# EAGLE design KeyboardTransformer (EAGLE 6.4)

## Sheet 1 of 3
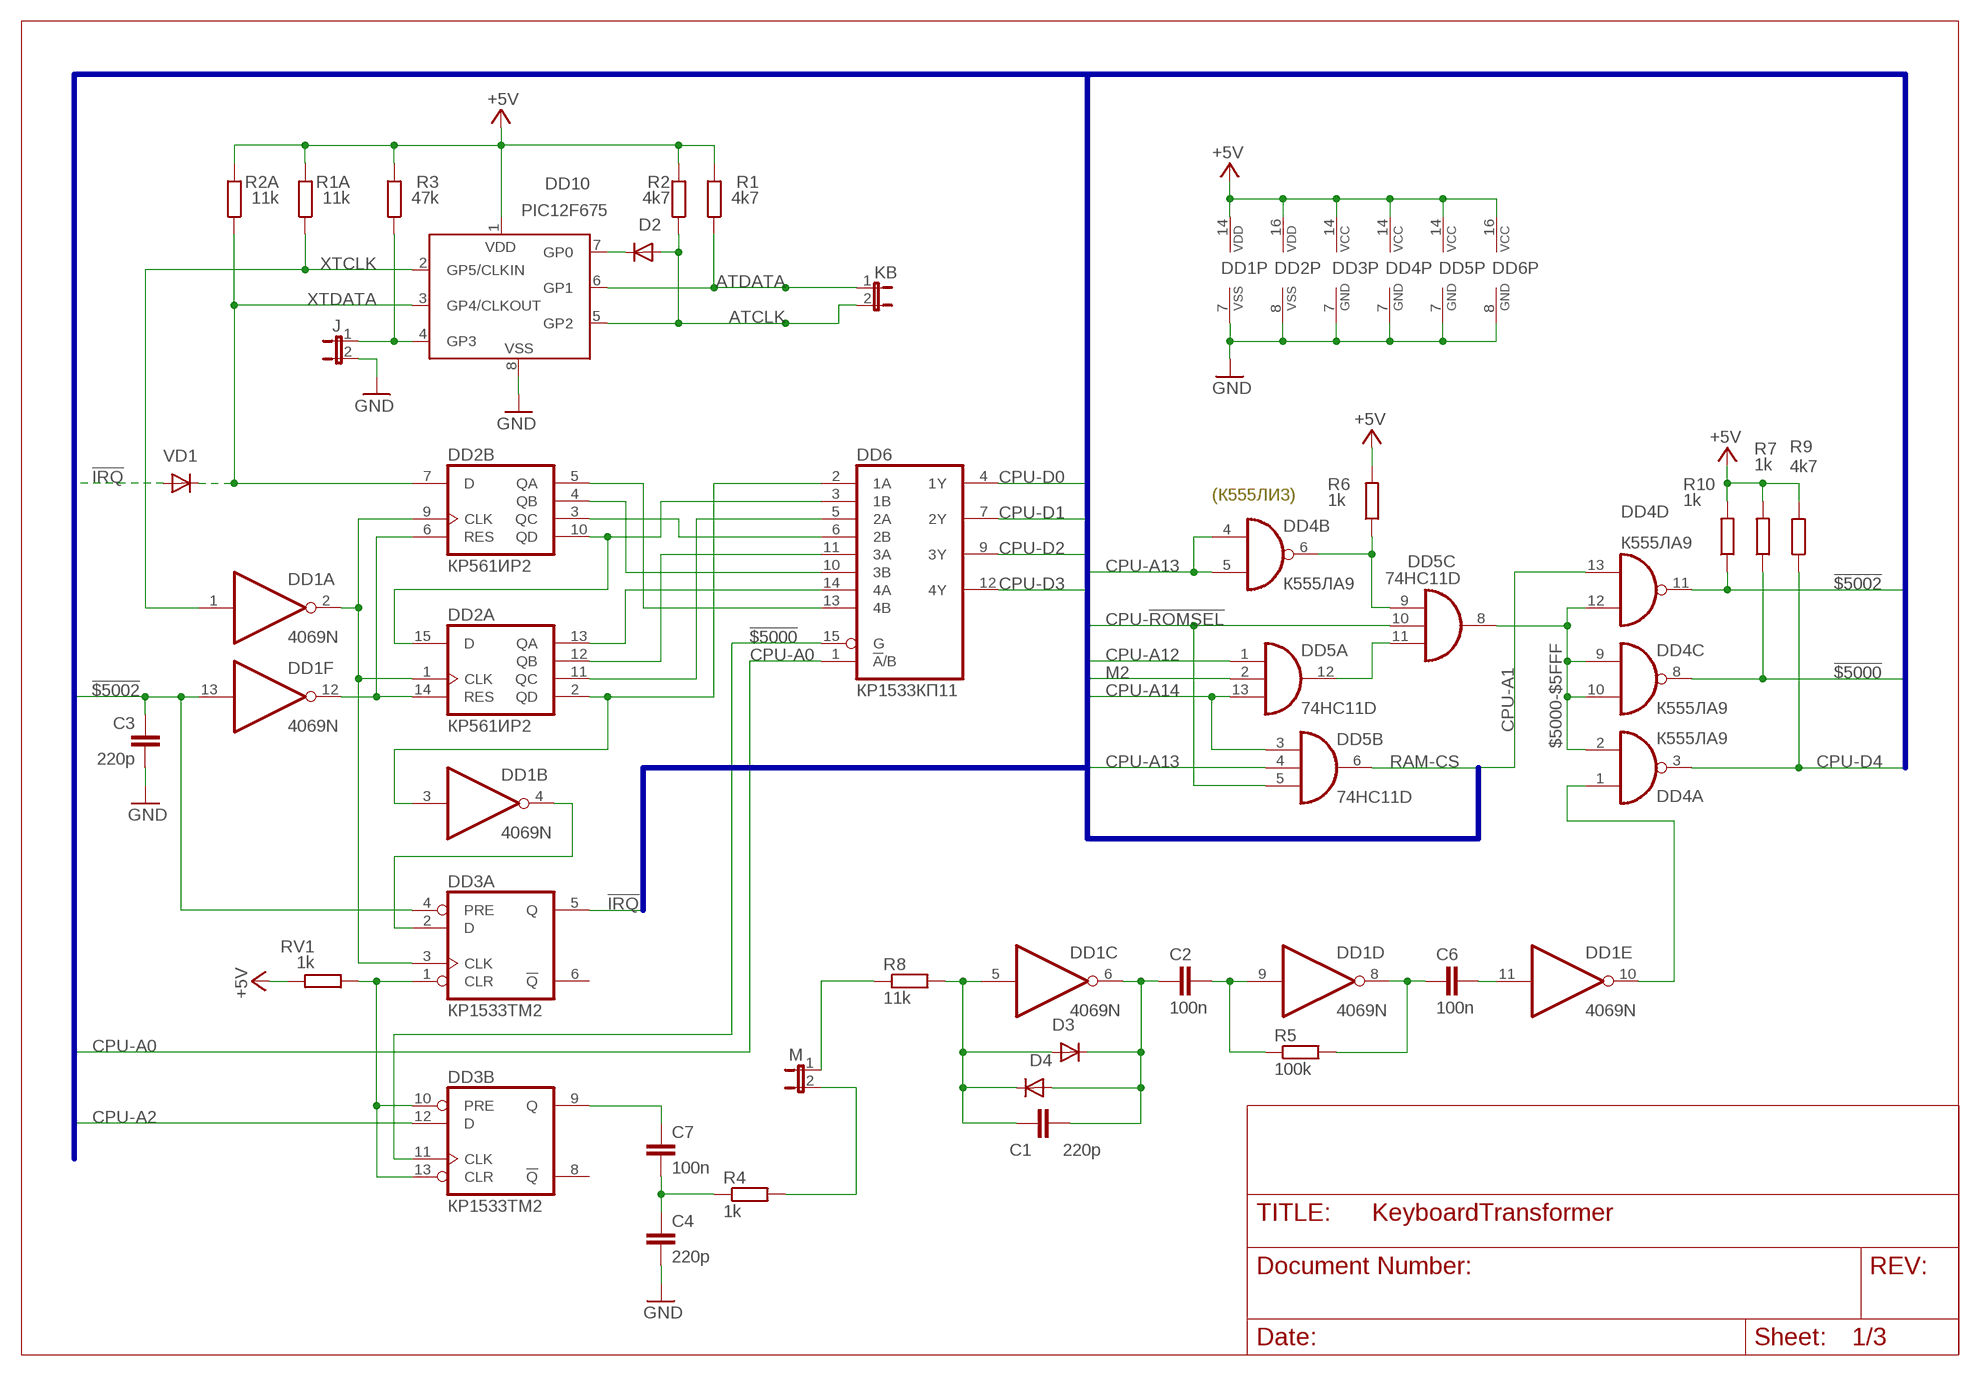
[diagram p0: schematic, sheet 1]

### Parts
C1  220p  C-EUC0805  [C0805]
C2  100n  C-EUC0805  [C0805]
C3  220p  C-EUC0805  [C0805]
C4  220p  C-EUC0805  [C0805]
C6  100n  C-EUC0805  [C0805]
C7  100n  C-EUC0805  [C0805]
D2  DIODE-SOD80C  [SOD80C]
D3  DIODE-SOD80C  [SOD80C]
D4  DIODE-SOD80C  [SOD80C]
DD1  4069N  [DIL14]
DD2  КР561ИР2  4015N  [DIL16]
DD3  КР1533ТМ2  74LS74N  [DIL14]
DD4  К555ЛА9  74LS03N  [DIL14]
DD5  74HC11D  [SO14]
DD6  КР1533КП11  74HC257N  [DIL16]
DD10  PIC12F675  PIC12F675SN  [SO-08]
J  JP1E  [JP1]
KB  JP1E  [JP1]
M  JP1E  [JP1]
R1  4k7  R-EU_M0805  [M0805]
R1A  11k  R-EU_M0805  [M0805]
R2  4k7  R-EU_M0805  [M0805]
R2A  11k  R-EU_M0805  [M0805]
R3  47k  R-EU_M0805  [M0805]
R4  1k  R-EU_M0805  [M0805]
R5  100k  R-EU_M0805  [M0805]
R6  1k  R-EU_M0805  [M0805]
R7  1k  R-EU_M0805  [M0805]
R8  11k  R-EU_M0805  [M0805]
R9  4k7  R-EU_M0805  [M0805]
R10  1k  R-EU_M0805  [M0805]
RV1  1k  R-EU_M0805  [M0805]
VD1  DIODE-SOD80C  [SOD80C]

### Nets
!$5000: DD3.11(B:CLK) DD4.8(C:O) DD6.15(G) R7.1
!$5002: C3.1 DD1.13(F:I) DD3.4(A:PRE) DD4.11(D:O) R10.1
!IRQ: DD3.5(A:Q) VD1.A ; also sheet 2
$5000-$5FFF: DD4.2(A:I1) DD4.9(C:I0) DD4.10(C:I1) DD4.12(D:I0) DD5.8(C:O)
+5V: DD1.14(P:VDD) DD2.16(P:VDD) DD3.14(P:VCC) DD4.14(P:VCC) DD5.14(P:VCC) DD6.16(VCC) DD10.1(VDD) R1.2 R1A.2 R2.2 R2A.2 R3.2 R6.2 R7.2 R9.2 R10.2 RV1.2 ; also sheet 2
ATCLK: D2.A DD10.5(GP2) KB.2 R2.1
ATDATA: DD10.6(GP1) KB.1 R1.1
CPU-!ROMSEL: DD5.5(B:I2) DD5.10(C:I1) ; also sheet 2,3
CPU-A0: DD6.1(!A!/B) ; also sheet 2
CPU-A1: DD4.13(D:I1) ; also sheet 2
CPU-A2: DD3.12(B:D) ; also sheet 2
CPU-A12: DD5.1(A:I0) ; also sheet 2,3
CPU-A13: DD4.4(B:I0) DD4.5(B:I1) DD5.4(B:I1) ; also sheet 2,3
CPU-A14: DD5.3(B:I0) DD5.13(A:I2) ; also sheet 2,3
CPU-D0: DD6.4(1Y) ; also sheet 2
CPU-D1: DD6.7(2Y) ; also sheet 2
CPU-D2: DD6.9(3Y) ; also sheet 2
CPU-D3: DD6.12(4Y) ; also sheet 2
CPU-D4: DD4.3(A:O) R9.1 ; also sheet 2
GND: C3.2 C4.2 DD1.7(P:VSS) DD2.8(P:VSS) DD3.7(P:GND) DD4.7(P:GND) DD5.7(P:GND) DD6.8(GND) DD10.8(VSS) J.2 ; also sheet 2
M2: DD5.2(A:I1) ; also sheet 2,3
N$1: DD3.1(A:CLR) DD3.10(B:PRE) DD3.13(B:CLR) RV1.1
N$2: DD2.10(B:QD) DD2.15(A:D) DD6.3(1B)
N$3: DD1.12(F:O) DD2.6(B:RES) DD2.14(A:RES)
N$4: DD1.2(A:O) DD2.1(A:CLK) DD2.9(B:CLK) DD3.3(A:CLK)
N$5: DD2.5(B:QA) DD6.13(4B)
N$6: DD2.4(B:QB) DD6.10(3B)
N$7: D2.C DD10.7(GP0)
N$8: DD2.3(B:QC) DD6.6(2B)
N$9: DD2.13(A:QA) DD6.14(4A)
N$10: DD2.12(A:QB) DD6.11(3A)
N$11: DD2.11(A:QC) DD6.5(2A)
N$12: DD10.4(GP3) J.1 R3.1
N$13: DD1.3(B:I) DD2.2(A:QD) DD6.2(1A)
N$14: DD1.4(B:O) DD3.2(A:D)
N$15: DD5.11(C:I2) DD5.12(A:O)
N$16: C7.1 DD3.9(B:Q)
N$17: C4.1 C7.2 R4.1
N$18: M.1 R8.1
N$19: DD4.6(B:O) DD5.9(C:I0) R6.1
N$20: C1.1 D3.A D4.C DD1.5(C:I) R8.2
N$21: C1.2 C2.1 D3.C D4.A DD1.6(C:O)
N$22: C6.2 DD1.11(E:I)
N$24: DD1.10(E:O) DD4.1(A:I0)
N$26: C2.2 DD1.9(D:I) R5.1
N$28: C6.1 DD1.8(D:O) R5.2
N$29: M.2 R4.2
RAM-CS: DD5.6(B:O) ; also sheet 2
XTCLK: DD1.1(A:I) DD10.2(GP5/CLKIN) R1A.1
XTDATA: DD2.7(B:D) DD10.3(GP4/CLKOUT) R2A.1 VD1.C
Unconnected: DD3.6(A:!Q) DD3.8(B:!Q)

### Buses
B$1

### Notes on the sheet
- (К555ЛИ3)

## Sheet 2 of 3
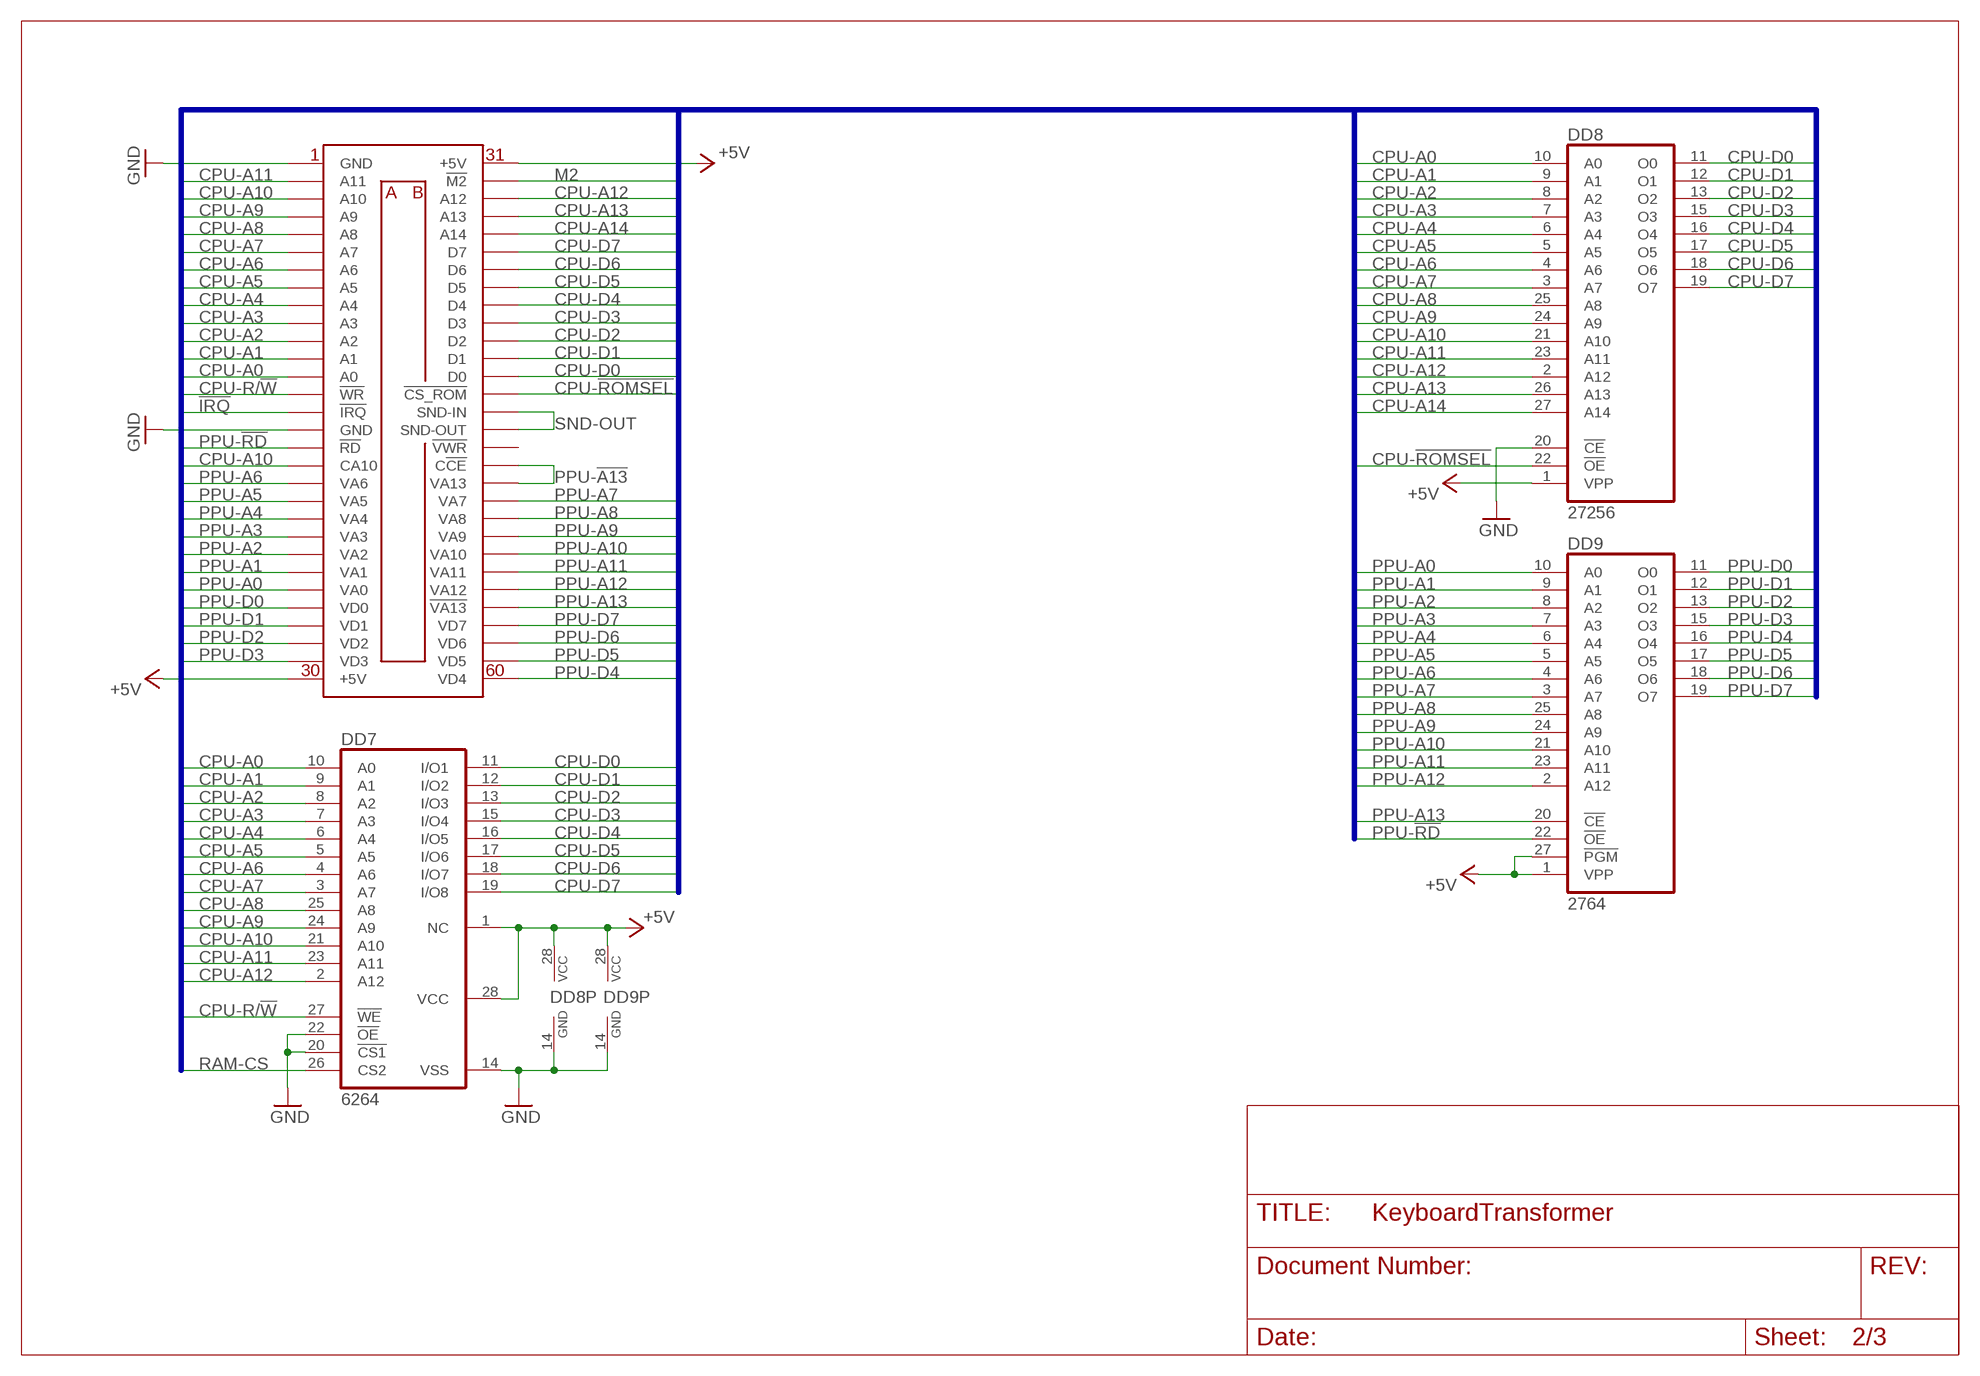
[diagram p1: schematic, sheet 2]

### Parts
DD7  6264  6264A  [DIL28-6]
DD8  27256  [DIL28]
DD9  2764  [DIL28]
U$1  CON60  [CON60]

### Nets
!IRQ: U$1.P$15(!IRQ) ; also sheet 1
+5V: DD7.1(NC) DD7.28(VCC) DD8.1(VPP) DD8.28(VCC) DD9.1(VPP) DD9.27(!PGM) DD9.28(VCC) U$1.P$30(+5V) U$1.P$31(+5V) ; also sheet 1
CPU-!ROMSEL: DD8.22(!OE) U$1.P$44(!CS_ROM) ; also sheet 1,3
CPU-A0: DD7.10(A0) DD8.10(A0) U$1.P$13(A0) ; also sheet 1
CPU-A1: DD7.9(A1) DD8.9(A1) U$1.P$12(A1) ; also sheet 1
CPU-A2: DD7.8(A2) DD8.8(A2) U$1.P$11(A2) ; also sheet 1
CPU-A3: DD7.7(A3) DD8.7(A3) U$1.P$10(A3)
CPU-A4: DD7.6(A4) DD8.6(A4) U$1.P$9(A4)
CPU-A5: DD7.5(A5) DD8.5(A5) U$1.P$8(A5)
CPU-A6: DD7.4(A6) DD8.4(A6) U$1.P$7(A6)
CPU-A7: DD7.3(A7) DD8.3(A7) U$1.P$6(A7)
CPU-A8: DD7.25(A8) DD8.25(A8) U$1.P$5(A8)
CPU-A9: DD7.24(A9) DD8.24(A9) U$1.P$4(A9)
CPU-A10: DD7.21(A10) DD8.21(A10) U$1.P$3(A10) U$1.P$18(CA10)
CPU-A11: DD7.23(A11) DD8.23(A11) U$1.P$2(A11)
CPU-A12: DD7.2(A12) DD8.2(A12) U$1.P$33(A12) ; also sheet 1,3
CPU-A13: DD8.26(A13) U$1.P$34(A13) ; also sheet 1,3
CPU-A14: DD8.27(A14) U$1.P$35(A14) ; also sheet 1,3
CPU-D0: DD7.11(I/O1) DD8.11(O0) U$1.P$43(D0) ; also sheet 1
CPU-D1: DD7.12(I/O2) DD8.12(O1) U$1.P$42(D1) ; also sheet 1
CPU-D2: DD7.13(I/O3) DD8.13(O2) U$1.P$41(D2) ; also sheet 1
CPU-D3: DD7.15(I/O4) DD8.15(O3) U$1.P$40(D3) ; also sheet 1
CPU-D4: DD7.16(I/O5) DD8.16(O4) U$1.P$39(D4) ; also sheet 1
CPU-D5: DD7.17(I/O6) DD8.17(O5) U$1.P$38(D5)
CPU-D6: DD7.18(I/O7) DD8.18(O6) U$1.P$37(D6)
CPU-D7: DD7.19(I/O8) DD8.19(O7) U$1.P$36(D7)
CPU-R/!W: DD7.27(!WE) U$1.P$14(!WR)
GND: DD7.14(VSS) DD7.20(!CS1) DD7.22(!OE) DD8.14(GND) DD8.20(!CE) DD9.14(GND) U$1.P$1(GND) U$1.P$16(GND) ; also sheet 1
M2: U$1.P$32(!M2) ; also sheet 1,3
PPU-!A13: U$1.P$48(C!CE) U$1.P$49(VA13)
PPU-!RD: DD9.22(!OE) U$1.P$17(!RD)
PPU-A0: DD9.10(A0) U$1.P$25(VA0)
PPU-A1: DD9.9(A1) U$1.P$24(VA1)
PPU-A2: DD9.8(A2) U$1.P$23(VA2)
PPU-A3: DD9.7(A3) U$1.P$22(VA3)
PPU-A4: DD9.6(A4) U$1.P$21(VA4)
PPU-A5: DD9.5(A5) U$1.P$20(VA5)
PPU-A6: DD9.4(A6) U$1.P$19(VA6)
PPU-A7: DD9.3(A7) U$1.P$50(VA7)
PPU-A8: DD9.25(A8) U$1.P$51(VA8)
PPU-A9: DD9.24(A9) U$1.P$52(VA9)
PPU-A10: DD9.21(A10) U$1.P$53(VA10)
PPU-A11: DD9.23(A11) U$1.P$54(VA11)
PPU-A12: DD9.2(A12) U$1.P$55(VA12)
PPU-A13: DD9.20(!CE) U$1.P$56(!VA13)
PPU-D0: DD9.11(O0) U$1.P$26(VD0)
PPU-D1: DD9.12(O1) U$1.P$27(VD1)
PPU-D2: DD9.13(O2) U$1.P$28(VD2)
PPU-D3: DD9.15(O3) U$1.P$29(VD3)
PPU-D4: DD9.16(O4) U$1.P$60(VD4)
PPU-D5: DD9.17(O5) U$1.P$59(VD5)
PPU-D6: DD9.18(O6) U$1.P$58(VD6)
PPU-D7: DD9.19(O7) U$1.P$57(VD7)
RAM-CS: DD7.26(CS2) ; also sheet 1
SND-OUT: U$1.P$45(SND-IN) U$1.P$46(SND-OUT)
Unconnected: U$1.P$47(!VWR)

### Buses
CPU-A[0..14],CPU-D[0..7],CPU-R/!W,CPU-!ROMSEL,PPU-A[0..13],PPU-D[0..7],PPU-!RD,RAM-CS,!IRQ,M2

## Sheet 3 of 3
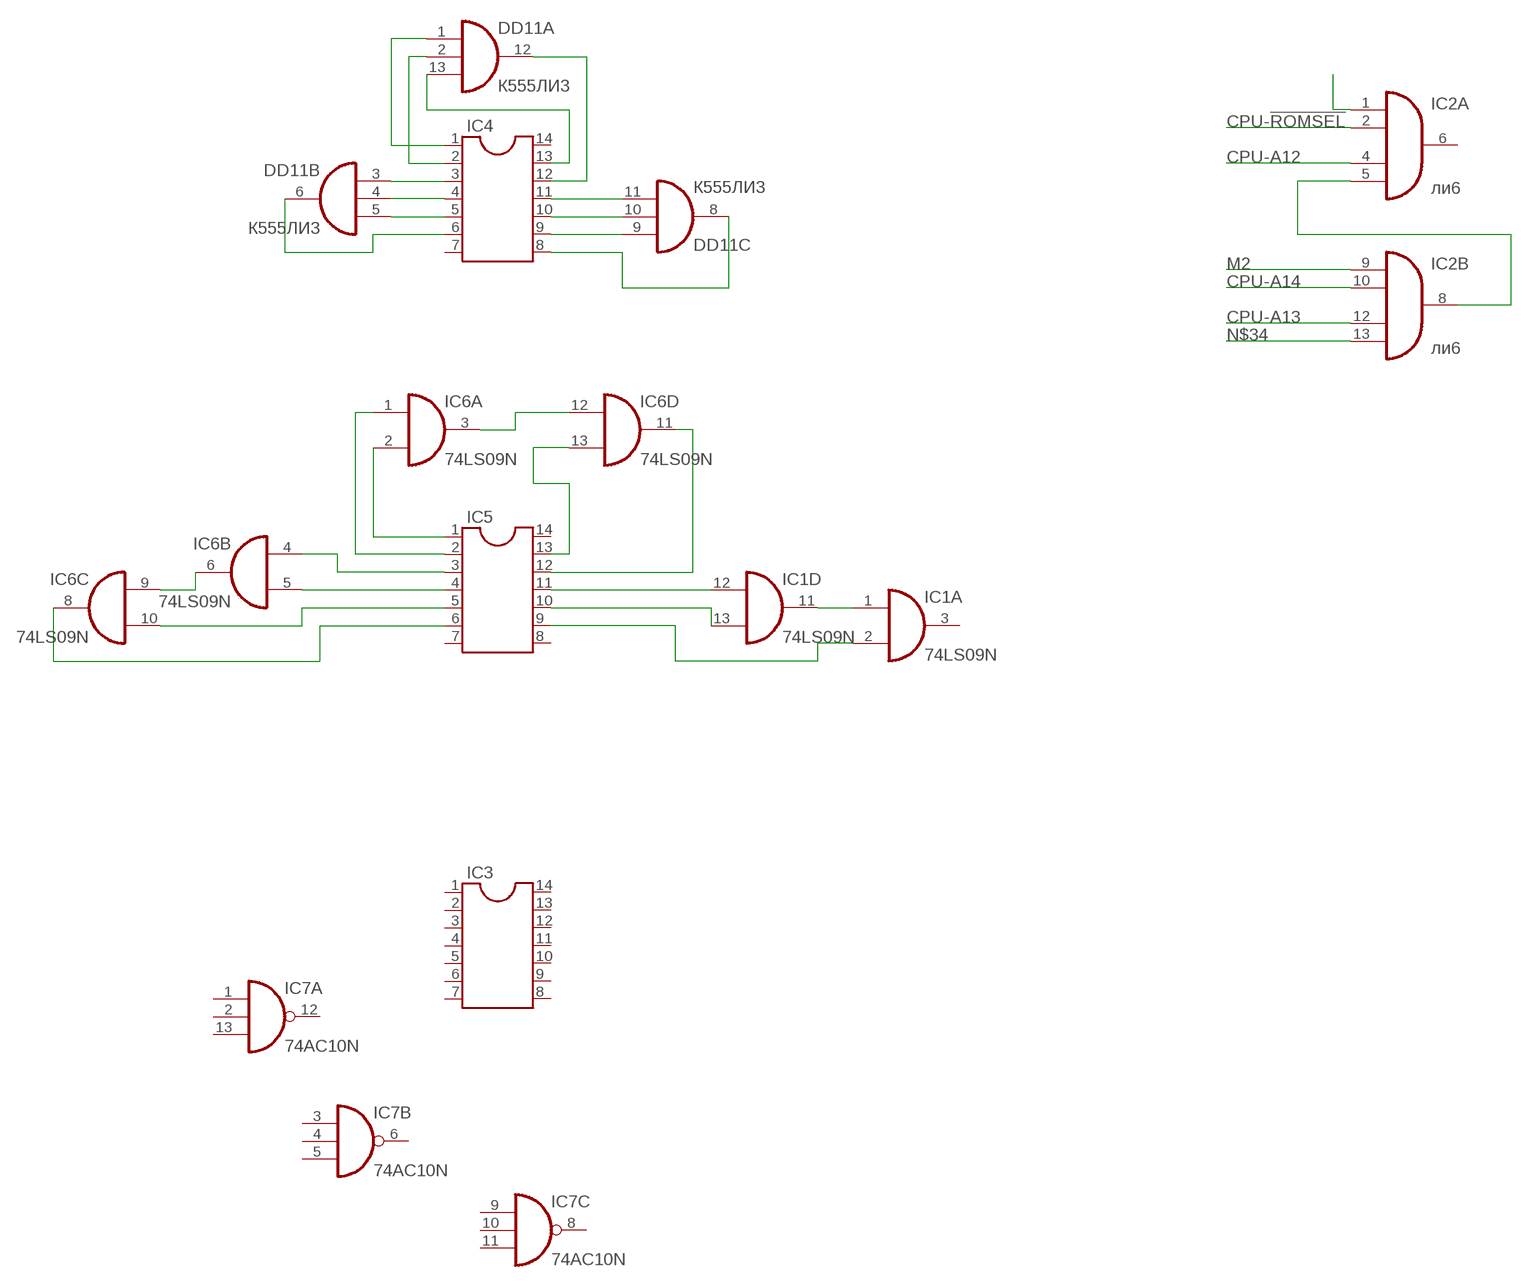
[diagram p2: schematic, sheet 3]

### Parts
DD11  К555ЛИ3  74HC11N  [DIL14]
IC1  74LS09N  [DIL14]
IC2  ли6  74AC21N  [DIL14]
IC3  DIL14  [DIL14]
IC4  DIL14  [DIL14]
IC5  DIL14  [DIL14]
IC6  74LS09N  [DIL14]
IC7  74AC10N  [DIL14]

### Nets
CPU-!ROMSEL: IC2.2(A:I1) ; also sheet 1,2
CPU-A12: IC2.4(A:I2) ; also sheet 1,2
CPU-A13: IC2.12(B:I2) ; also sheet 1,2
CPU-A14: IC2.10(B:I1) ; also sheet 1,2
M2: IC2.9(B:I0) ; also sheet 1,2
N$23: IC6.3(A:O) IC6.12(D:I0)
N$25: IC5.1 IC6.2(A:I1)
N$27: IC5.2 IC6.1(A:I0)
N$30: IC5.13 IC6.13(D:I1)
N$31: IC5.12 IC6.11(D:O)
N$32: DD11.13(A:I2) IC4.13
N$33: IC2.5(A:I3) IC2.8(B:O)
N$34: IC2.13(B:I3)
N$35: DD11.12(A:O) IC4.12
N$36: DD11.2(A:I1) IC4.2
N$37: DD11.1(A:I0) IC4.1
N$38: IC2.1(A:I0)
N$39: DD11.3(B:I0) IC4.3
N$40: DD11.4(B:I1) IC4.4
N$41: DD11.5(B:I2) IC4.5
N$42: DD11.6(B:O) IC4.6
N$43: DD11.11(C:I2) IC4.11
N$44: DD11.10(C:I1) IC4.10
N$45: DD11.9(C:I0) IC4.9
N$46: DD11.8(C:O) IC4.8
N$47: IC5.3 IC6.4(B:I0)
N$48: IC5.4 IC6.5(B:I1)
N$49: IC6.6(B:O) IC6.9(C:I0)
N$50: IC5.5 IC6.10(C:I1)
N$51: IC5.6 IC6.8(C:O)
N$52: IC1.12(D:I0) IC5.11
N$53: IC1.13(D:I1) IC5.10
N$54: IC1.1(A:I0) IC1.11(D:O)
N$55: IC1.2(A:I1) IC5.9
Unconnected: IC1.3(A:O) IC1.4(B:I0) IC1.5(B:I1) IC1.6(B:O) IC1.8(C:O) IC1.9(C:I0) IC1.10(C:I1) IC2.6(A:O) IC3.1 IC3.2 IC3.3 IC3.4 IC3.5 IC3.6 IC3.7 IC3.8 IC3.9 IC3.10 IC3.11 IC3.12 IC3.13 IC3.14 IC4.7 IC4.14 IC5.7 IC5.8 IC5.14 IC7.1(A:I0) IC7.2(A:I1) IC7.3(B:I0) IC7.4(B:I1) IC7.5(B:I2) IC7.6(B:O) IC7.8(C:O) IC7.9(C:I0) IC7.10(C:I1) IC7.11(C:I2) IC7.12(A:O) IC7.13(A:I2)

## Power pins joined to a net without a drawn wire
GND: DD11.7(P:GND) IC1.7(P:GND) IC2.7(P:GND) IC6.7(P:GND) IC7.7(P:GND)
VCC: DD11.14(P:VCC) IC1.14(P:VCC) IC2.14(P:VCC) IC6.14(P:VCC) IC7.14(P:VCC)

## Library data of the parts
C1-C4 C6 C7 = rcl:C-EU: CAPACITOR, European symbol
D2-D4 VD1 = diode:DIODE-: DIODE
DD1 = 40xx:4069: Hex INVERTER
DD2 = 40xx:4015: Dual 4-bit static SHIFT REGISTER
DD3 = 74xx-eu:74*74: Dual D type positive edge triggered FLIP FLOP, preset and clear
DD4 = 74xx-eu:74*03: Quad 2-input NAND gate, open collector output
DD5 DD11 = 74xx-eu:74*11: Triple 3-input AND gate
DD6 = 74xx-eu:74*257: Quadruple 2-to 1 line data SELECTOR/MULTIPLEXER
DD7 = memory-hitachi:6264A: MEMORY; OC_FARNELL: 283605; OC_NEWARK: unknown
DD8 = memory:27256: MEMORY
DD9 = memory:2764: MEMORY
DD10 = microchip:PIC12F6*: Data Sheet 8-Pin FLASH-Based 8-Bit CMOS Microcontrollers Source: http://www.microchip.com .. 41190c.pdf; MF: MICROCHIP; MPN: PIC12F675-E/SN; OC_FARNELL: 9759026; OC_NEWARK: 92C4341
IC1 IC6 = 74xx-eu:74*09: Quad 2-input AND gate, open collector
IC2 = 74xx-eu:74*21: Dual 4-input AND gate
IC3-IC5 = ic-package:DIL14: Dual In Line / Socket
IC7 = 74xx-eu:74*10: Triple 3-input NAND gate
J KB M = jumper:JP1E: JUMPER
R1 R1A R2 R2A R3-R10 RV1 = rcl:R-EU_: RESISTOR, European symbol
U$1 = dkt:CON60

## Board
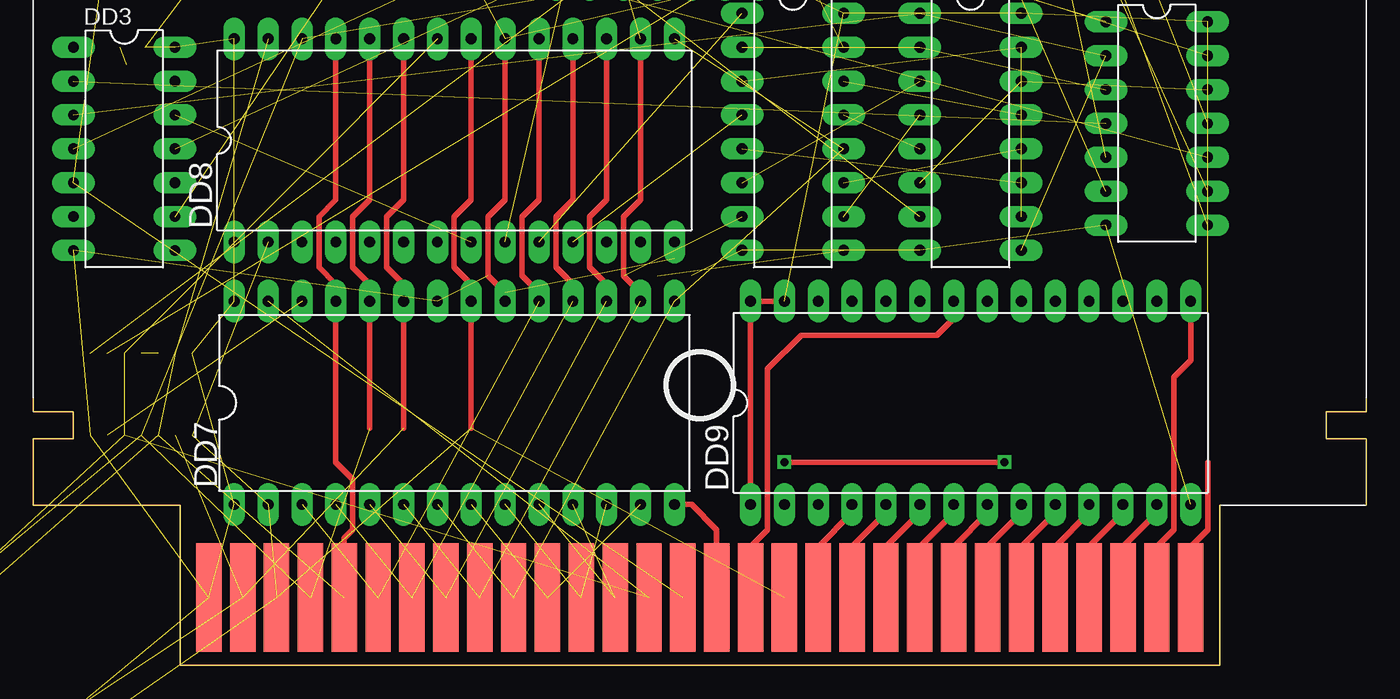
[diagram p3: board, top side]
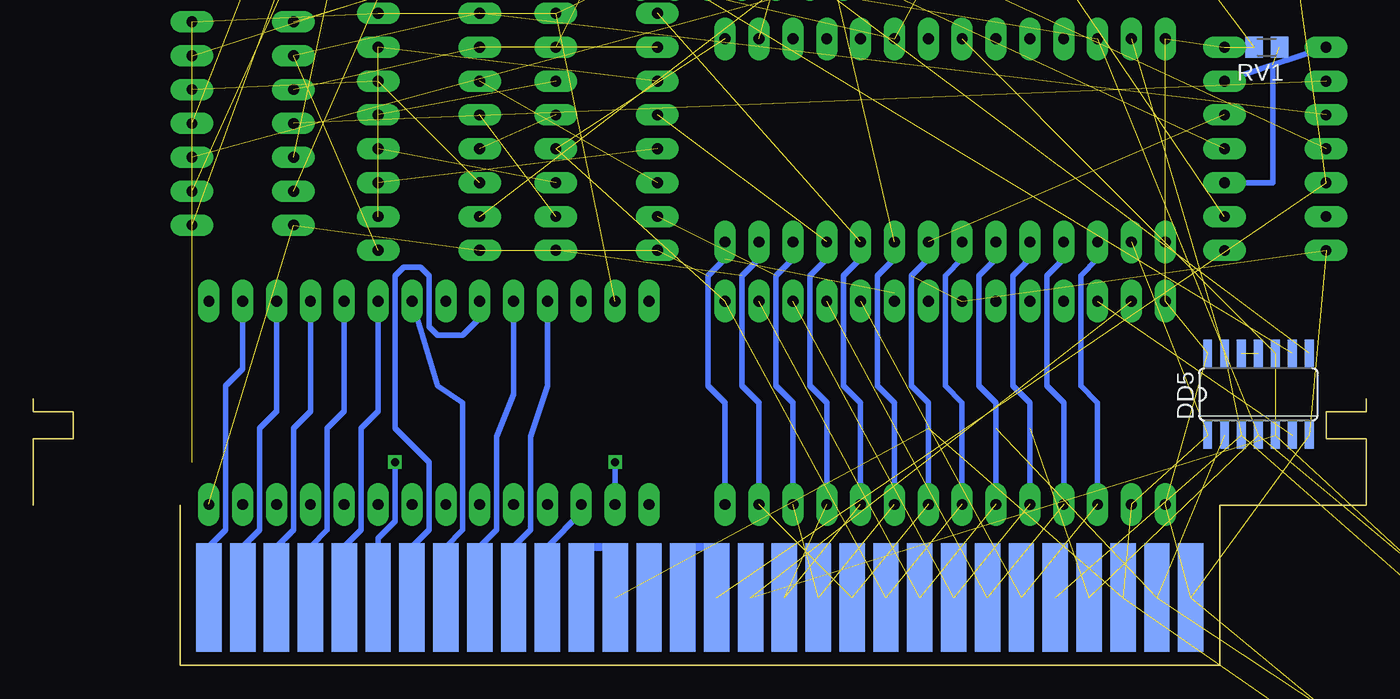
[diagram p4: board, bottom side, seen from below]

Size 100 x 20 mm. Coordinates in mm from the lower left corner, seen from the top.
Copper layers (1*16): Top 0.035mm / dielectric 1.5mm / Bottom 0.035mm
Design rules "default": minimum track width 10mil, minimum drill 24mil, track to track 8mil, track to pad 8mil, pad to pad 8mil, via to via 8mil, smd to smd 8mil, copper to edge 40mil, drill to drill 7mil, minimum pad ring 0.4mm, minimum via ring 8mil, stop-mask expansion 4mil, vias tented up to drill 0mil, thermal gap 10mil

### Footprints (pad centres in the part's own frame; a part is rotated, then mirrored left to right if it is on the bottom)
C0805 = smd 1.3 x 1.5: 1 -0.95,0; 2 0.95,0
SOD80C = smd 1.4 x 1.8: A 1.7,0; C -1.7,0
DIL14 = drill 0.813 long: 1 -7.62,-3.81; 2 -5.08,-3.81; 3 -2.54,-3.81; 4 0,-3.81; 5 2.54,-3.81; 6 5.08,-3.81; 7 7.62,-3.81; 8 7.62,3.81; 9 5.08,3.81; 10 2.54,3.81; 11 0,3.81; 12 -2.54,3.81; 13 -5.08,3.81; 14 -7.62,3.81
DIL16 = drill 0.813 long: 1 -8.89,-3.81; 2 -6.35,-3.81; 3 -3.81,-3.81; 4 -1.27,-3.81; 5 1.27,-3.81; 6 3.81,-3.81; 7 6.35,-3.81; 8 8.89,-3.81; 9 8.89,3.81; 10 6.35,3.81; 11 3.81,3.81; 12 1.27,3.81; 13 -1.27,3.81; 14 -3.81,3.81; 15 -6.35,3.81; 16 -8.89,3.81
SO14 = smd 0.66 x 2.032: 1 -3.81,-3.073; 2 -2.54,-3.073; 3 -1.27,-3.073; 4 0,-3.073; 5 1.27,-3.073; 6 2.54,-3.073; 7 3.81,-3.073; 8 3.81,3.073; 9 2.54,3.073; 10 1.27,3.073; 11 0,3.073; 12 -1.27,3.073; 13 -2.54,3.073; 14 -3.81,3.073
DIL28-6 = drill 0.813 long: 1 -16.51,-7.62; 2 -13.97,-7.62; 3 -11.43,-7.62; 4 -8.89,-7.62; 5 -6.35,-7.62; 6 -3.81,-7.62; 7 -1.27,-7.62; 8 1.27,-7.62; 9 3.81,-7.62; 10 6.35,-7.62; 11 8.89,-7.62; 12 11.43,-7.62; 13 13.97,-7.62; 14 16.51,-7.62; 15 16.51,7.62; 16 13.97,7.62; 17 11.43,7.62; 18 8.89,7.62; 19 6.35,7.62; 20 3.81,7.62; 21 1.27,7.62; 22 -1.27,7.62; 23 -3.81,7.62; 24 -6.35,7.62; 25 -8.89,7.62; 26 -11.43,7.62; 27 -13.97,7.62; 28 -16.51,7.62
DIL28 = drill 0.813 long: 1 -16.51,-7.62; 2 -13.97,-7.62; 3 -11.43,-7.62; 4 -8.89,-7.62; 5 -6.35,-7.62; 6 -3.81,-7.62; 7 -1.27,-7.62; 8 1.27,-7.62; 9 3.81,-7.62; 10 6.35,-7.62; 11 8.89,-7.62; 12 11.43,-7.62; 13 13.97,-7.62; 14 16.51,-7.62; 15 16.51,7.62; 16 13.97,7.62; 17 11.43,7.62; 18 8.89,7.62; 19 6.35,7.62; 20 3.81,7.62; 21 1.27,7.62; 22 -1.27,7.62; 23 -3.81,7.62; 24 -6.35,7.62; 25 -8.89,7.62; 26 -11.43,7.62; 27 -13.97,7.62; 28 -16.51,7.62
SO-08 = smd 0.6 x 2.2: 1 -1.905,-2.6; 2 -0.635,-2.6; 3 0.635,-2.6; 4 1.905,-2.6; 5 1.905,2.6; 6 0.635,2.6; 7 -0.635,2.6; 8 -1.905,2.6
JP1 = drill 0.914 long: 1 0,-1.27; 2 0,1.27
M0805 = smd 1.3 x 1.6: 1 -0.95,0; 2 0.95,0
CON60 = smd 1.905 x 8.128: P$1 -36.83,5.08; P$2 -34.29,5.08; P$3 -31.75,5.08; P$4 -29.21,5.08; P$5 -26.67,5.08; P$6 -24.13,5.08; P$7 -21.59,5.08; P$8 -19.05,5.08; P$9 -16.51,5.08; P$10 -13.97,5.08; P$11 -11.43,5.08; P$12 -8.89,5.08; P$13 -6.35,5.08; P$14 -3.81,5.08; P$15 -1.27,5.08; P$16 1.27,5.08; P$17 3.81,5.08; P$18 6.35,5.08; P$19 8.89,5.08; P$20 11.43,5.08; P$21 13.97,5.08; P$22 16.51,5.08; P$23 19.05,5.08; P$24 21.59,5.08; P$25 24.13,5.08; P$26 26.67,5.08; P$27 29.21,5.08; P$28 31.75,5.08; P$29 34.29,5.08; P$30 36.83,5.08 | smd 1.905 x 8.128 bottom: P$31 -36.83,5.08; P$32 -34.29,5.08; P$33 -31.75,5.08; P$34 -29.21,5.08; P$35 -26.67,5.08; P$36 -24.13,5.08; P$37 -21.59,5.08; P$38 -19.05,5.08; P$39 -16.51,5.08; P$40 -13.97,5.08; P$41 -11.43,5.08; P$42 -8.89,5.08; P$43 -6.35,5.08; P$44 -3.81,5.08; P$45 -1.27,5.08; P$46 1.27,5.08; P$47 3.81,5.08; P$48 6.35,5.08; P$49 8.89,5.08; P$50 11.43,5.08; P$51 13.97,5.08; P$52 16.51,5.08; P$53 19.05,5.08; P$54 21.59,5.08; P$55 24.13,5.08; P$56 26.67,5.08; P$57 29.21,5.08; P$58 31.75,5.08; P$59 34.29,5.08; P$60 36.83,5.08

### Placement (x,y rotation side)
C1  37.3,120.65 90 top  (outside the outline)
C2  43.65,120.65 90 top  (outside the outline)
C3  30.95,110.49 90 top  (outside the outline)
C4  74.77,110.49 90 top  (outside the outline)
C6  56.35,120.65 90 top  (outside the outline)
C7  62.06,110.49 90 top  (outside the outline)
D2  25.23,73.03 0 top  (outside the outline)
D3  27.14,121.92 90 top  (outside the outline)
D4  32.22,121.92 90 top  (outside the outline)
DD1  84.29,40.64 270 top  (outside the outline)
DD2  70.32,40.01 270 top  (outside the outline)
DD3  6.82,38.73 270 top  (outside the outline)
DD4  46.83,55.24 0 top  (outside the outline)
DD5  8.09,20.32 0 bottom
DD6  56.98,40.01 270 top  (outside the outline)
DD7  31.59,19.68 0 top
DD8  31.59,39.37 0 top  (outside the outline)
DD9  70.32,19.68 0 top
DD10  24.6,67.94 0 top  (outside the outline)
DD11  -22.39,-73.66 0 top  (outside the outline)
IC1  -64.3,-101.6 0 top  (outside the outline)
IC2  -60.49,-45.72 0 top  (outside the outline)
IC3  -64.3,-114.3 0 top  (outside the outline)
IC4  -35.09,-53.34 0 top  (outside the outline)
IC5  -64.3,-69.85 0 top  (outside the outline)
IC6  -45.25,-88.9 0 top  (outside the outline)
IC7  -64.3,-127 0 top  (outside the outline)
J  20.16,67.94 0 top  (outside the outline)
KB  13.17,73.66 0 top  (outside the outline)
M  90.64,69.22 0 top  (outside the outline)
R1  29.05,69.22 0 top  (outside the outline)
R1A  18.25,110.49 90 top  (outside the outline)
R2  30.32,72.39 270 top  (outside the outline)
R2A  24.6,110.49 90 top  (outside the outline)
R3  29.68,66.04 90 top  (outside the outline)
R4  81.11,110.49 90 top  (outside the outline)
R5  50,120.65 90 top  (outside the outline)
R6  20.79,120.65 90 top  (outside the outline)
R7  55.72,110.49 90 top  (outside the outline)
R8  62.7,120.65 90 top  (outside the outline)
R9  69.05,120.65 90 top  (outside the outline)
R10  75.4,120.65 90 top  (outside the outline)
RV1  7.45,46.35 180 bottom  (outside the outline)
U$1  50,0 0 top
VD1  13.8,111.12 90 top  (outside the outline)

### Tracks (layer width: path | path; a pad name or v marks a point on that pad's centre or on a via)
!$5000  (3 unrouted)
!$5002  (4 unrouted)
!IRQ  (2 unrouted)
$5000-$5FFF  (4 unrouted)
+5V  (23 unrouted)
  Top 0.406: U$1.P$30 86.83,8.89 88.1,10.16 88.1,15.24 | DD9.1 DD9.28 DD9.27
ATCLK  (3 unrouted)
ATDATA  (2 unrouted)
CPU-!ROMSEL  (4 unrouted)
CPU-A0  (2 unrouted)
  Bottom 0.406: DD8.10 37.94,30.48 39.2,29.21 39.2,20.95 37.94,19.68 DD7.10
CPU-A1  (2 unrouted)
  Bottom 0.406: DD8.9 35.39,30.48 36.66,29.21 36.66,20.95 35.39,19.68 DD7.9
CPU-A2  (2 unrouted)
  Bottom 0.406: DD8.8 32.86,30.48 34.12,29.21 34.12,20.95 32.86,19.68 DD7.8
CPU-A3  (1 unrouted)
  Bottom 0.406: DD8.7 30.32,30.48 31.59,29.21 31.59,20.95 30.32,19.68 DD7.7
CPU-A4  (1 unrouted)
  Bottom 0.406: DD8.6 27.77,30.48 29.05,29.21 29.05,20.95 27.77,19.68 DD7.6
CPU-A5  (1 unrouted)
  Bottom 0.406: DD8.5 25.23,30.48 26.5,29.21 26.5,20.95 25.23,19.68 DD7.5
CPU-A6  (1 unrouted)
  Bottom 0.406: DD8.4 22.7,30.48 23.96,29.21 23.96,20.95 22.7,19.68 DD7.4
CPU-A7  (1 unrouted)
  Bottom 0.406: DD8.3 20.16,30.48 21.43,29.21 21.43,20.95 20.16,19.68 DD7.3
CPU-A8
  Top 0.406: DD8.25 22.7,34.92 21.43,33.66 21.43,29.84 22.7,28.57 DD7.25 22.7,15.24 23.96,13.97 23.96,10.16 23.33,9.53 U$1.P$5
CPU-A9  (1 unrouted)
  Top 0.406: DD8.24 25.23,34.92 23.96,33.66 23.96,29.84 25.23,28.57 DD7.24 25.23,17.78
CPU-A10  (2 unrouted)
  Top 0.406: DD8.21 32.86,34.92 31.59,33.66 31.59,29.84 32.86,28.57 DD7.21 32.86,17.78
CPU-A11  (1 unrouted)
  Top 0.406: DD8.23 27.77,34.92 26.5,33.66 26.5,29.84 27.77,28.57 DD7.23 27.77,17.78
CPU-A12  (4 unrouted)
CPU-A13  (5 unrouted)
CPU-A14  (4 unrouted)
CPU-D0  (2 unrouted)
  Bottom 0.406: DD8.11 40.48,30.48 41.74,29.21 41.74,20.95 40.48,19.68 DD7.11
CPU-D1  (2 unrouted)
  Bottom 0.406: DD8.12 43.02,30.48 44.28,29.21 44.28,20.95 43.02,19.68 DD7.12
CPU-D2  (2 unrouted)
  Bottom 0.406: DD8.13 45.55,30.48 46.83,29.21 46.83,20.95 45.55,19.68 DD7.13
CPU-D3  (3 unrouted)
CPU-D4  (3 unrouted)
  Top 0.406: DD8.16 45.55,34.92 44.28,33.66 44.28,29.21 45.55,27.94 DD7.16
CPU-D5  (1 unrouted)
  Top 0.406: DD8.17 43.02,34.92 41.74,33.66 41.74,29.84 43.02,28.57 DD7.17
CPU-D6  (1 unrouted)
  Top 0.406: DD8.18 40.48,34.92 39.2,33.66 39.2,29.84 40.48,28.57 DD7.18
CPU-D7  (1 unrouted)
  Top 0.406: DD8.19 37.94,34.92 36.66,33.66 36.66,29.21 37.94,27.94 DD7.19
CPU-R/!W  (1 unrouted)
GND  (19 unrouted)
  Top 0.406: U$1.P$16 51.27,10.16 49.37,12.06 DD7.14 | DD8.20 35.39,34.92 34.12,33.66 34.12,29.21 35.39,27.94 DD7.20
  Bottom 0.406: DD8.14 48.09,30.48 49.37,29.21 49.37,20.95 48.09,19.68 DD7.14
M2  (2 unrouted)
N$1  (1 unrouted)
  Bottom 0.406: DD3.1 7.01,45.02 | 7.01,45.02 DD3.13 | DD3.10 7.01,36.2 7.01,45.02
N$2  (2 unrouted)
N$3  (2 unrouted)
N$4  (3 unrouted)
N$5  (1 unrouted)
N$6  (1 unrouted)
N$7  (1 unrouted)
N$8  (1 unrouted)
N$9  (1 unrouted)
N$10  (1 unrouted)
N$11  (1 unrouted)
N$12  (2 unrouted)
N$13  (2 unrouted)
N$14  (1 unrouted)
N$15  (1 unrouted)
N$16  (1 unrouted)
N$17  (2 unrouted)
N$18  (1 unrouted)
N$19  (2 unrouted)
N$20  (4 unrouted)
N$21  (4 unrouted)
N$22  (1 unrouted)
N$23  (1 unrouted)
N$24  (1 unrouted)
N$25  (1 unrouted)
N$26  (2 unrouted)
N$27  (1 unrouted)
N$28  (2 unrouted)
N$29  (1 unrouted)
N$30  (1 unrouted)
N$31  (1 unrouted)
N$32  (1 unrouted)
N$33  (1 unrouted)
N$35  (1 unrouted)
N$36  (1 unrouted)
N$37  (1 unrouted)
N$39  (1 unrouted)
N$40  (1 unrouted)
N$41  (1 unrouted)
N$42  (1 unrouted)
N$43  (1 unrouted)
N$44  (1 unrouted)
N$45  (1 unrouted)
N$46  (1 unrouted)
N$47  (1 unrouted)
N$48  (1 unrouted)
N$49  (1 unrouted)
N$50  (1 unrouted)
N$51  (1 unrouted)
N$52  (1 unrouted)
N$53  (1 unrouted)
N$54  (1 unrouted)
N$55  (1 unrouted)
PPU-!A13
  Bottom 0.61: U$1.P$49 58.89,8.89 56.35,8.89 U$1.P$48
PPU-!RD
  Top 0.406: U$1.P$17 53.81,8.89 55.08,10.16 55.08,22.23 57.62,24.77 67.78,24.77 69.05,26.04 DD9.22
PPU-A0
  Top 0.406: DD9.10 76.67,11.43 74.13,8.89 U$1.P$25
PPU-A1
  Top 0.406: DD9.9 74.13,11.43 71.59,8.89 U$1.P$24
PPU-A2
  Top 0.406: DD9.8 71.59,11.43 69.05,8.89 U$1.P$23
PPU-A3
  Top 0.406: DD9.7 69.05,11.43 66.51,8.89 U$1.P$22
PPU-A4
  Top 0.406: DD9.6 66.51,11.43 63.97,8.89 U$1.P$21
PPU-A5
  Top 0.406: DD9.5 63.97,11.43 61.43,8.89 U$1.P$20
PPU-A6
  Top 0.406: DD9.4 61.43,11.43 58.89,8.89 U$1.P$19
PPU-A7
  Bottom 0.406: U$1.P$50 61.43,8.89 58.89,11.43 DD9.3
PPU-A8
  Bottom 0.406: U$1.P$51 63.97,8.89 62.7,10.16 62.7,17.14 61.43,20.95 DD9.25
PPU-A9
  Bottom 0.406: U$1.P$52 66.51,8.89 65.24,10.16 65.24,17.14 63.97,20.32 DD9.24
PPU-A10
  Bottom 0.406: U$1.P$53 69.05,8.89 67.78,10.16 67.78,19.68 69.69,20.95 DD9.21
PPU-A11
  Bottom 0.406: U$1.P$54 71.59,8.89 70.32,10.16 70.32,15.24 72.86,17.78 72.86,29.21 72.22,29.84 70.95,29.84 70.32,29.21 70.32,25.4 69.69,24.77 67.78,24.77 66.51,26.04 DD9.23
PPU-A12  (via drill 0.6)
  Top 0.406: v72.86,15.24 v56.35,15.24
  Bottom 0.406: U$1.P$55 74.13,9.53 72.86,10.79 v72.86,15.24 | v56.35,15.24 DD9.2
PPU-A13
  Bottom 0.406: U$1.P$56 76.67,8.89 75.4,10.16 75.4,17.78 74.13,19.05 DD9.20
PPU-D0
  Top 0.406: DD9.11 79.21,11.43 76.67,8.89 U$1.P$26
PPU-D1
  Top 0.406: DD9.12 81.75,11.43 79.21,8.89 U$1.P$27
PPU-D2
  Top 0.406: DD9.13 84.29,11.43 81.75,8.89 U$1.P$28
PPU-D3
  Top 0.406: U$1.P$29 84.29,8.89 85.56,10.16 85.56,21.59 86.83,22.86 DD9.15
PPU-D4
  Bottom 0.406: U$1.P$60 86.83,8.89 85.56,10.16 85.56,20.95 84.29,22.23 DD9.16
PPU-D5
  Bottom 0.406: U$1.P$59 84.29,8.89 83.02,10.16 83.02,17.78 81.75,19.05 DD9.17
PPU-D6
  Bottom 0.406: U$1.P$58 81.75,8.89 80.48,10.16 80.48,17.78 79.21,19.05 DD9.18
PPU-D7
  Bottom 0.406: U$1.P$57 79.21,8.89 77.94,10.16 77.94,17.78 76.67,19.05 DD9.19
RAM-CS  (1 unrouted)
SND-OUT
  Bottom 0.61: U$1.P$46 51.27,8.89 48.73,8.89 U$1.P$45
VCC  (4 unrouted)
XTCLK  (2 unrouted)
XTDATA  (3 unrouted)

### Text on the board
Top: 10x6cm